# Altium schematic sheet curr_sens_sch.SchDoc
size A; SheetNumber: 1; SheetTotal: 1
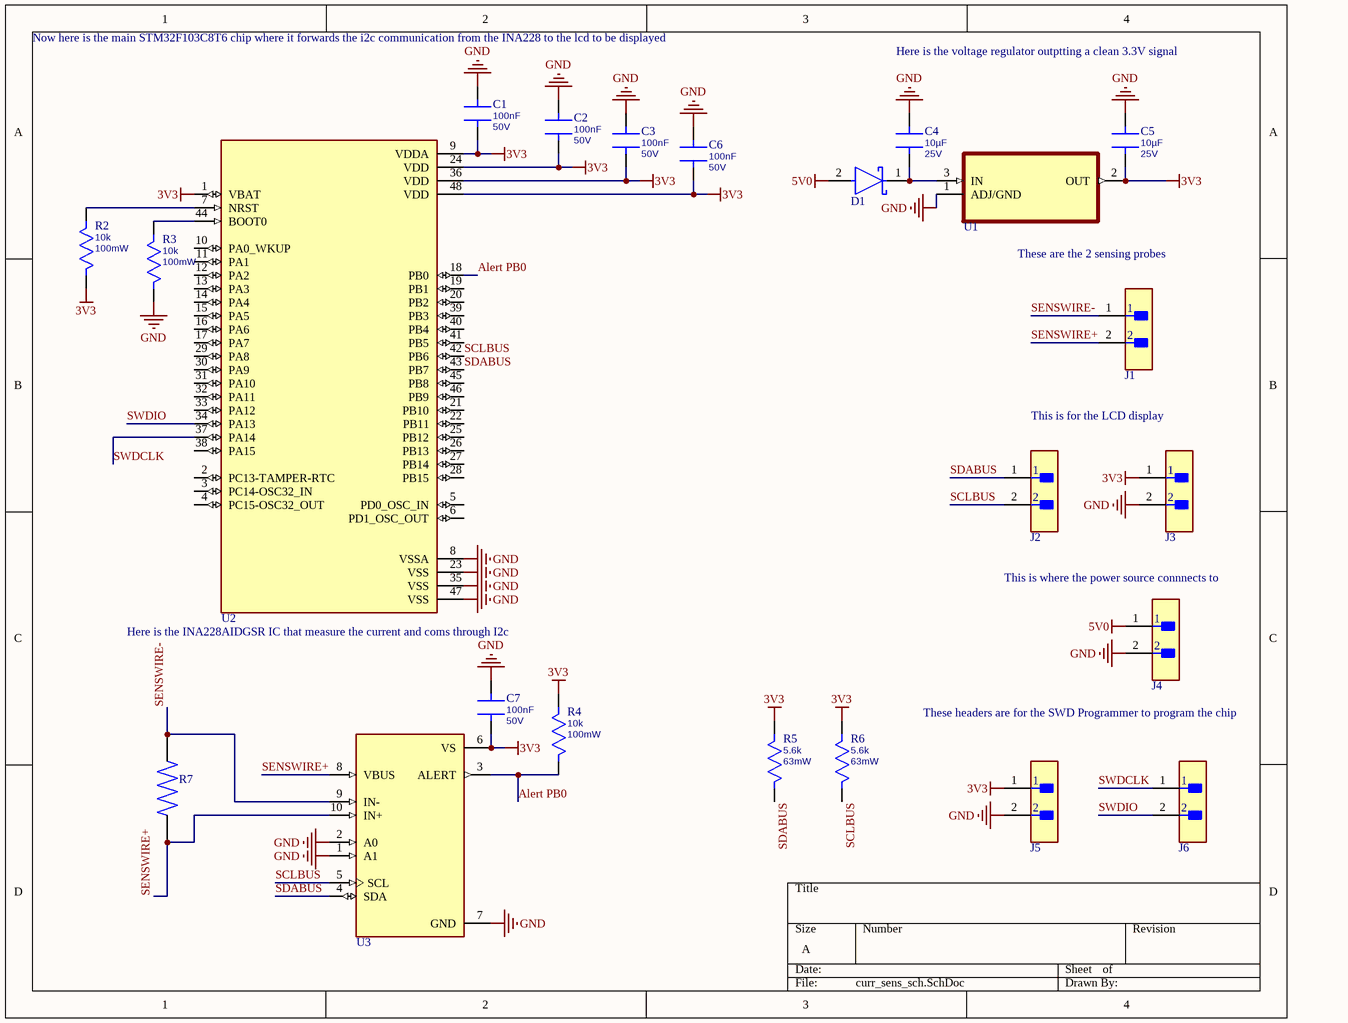
[diagram p0: curr_sens_sch.SchDoc]

## Parts
C1  Capacitance: 100nF  Voltage Rating: 50V  [Standard 0603]  (hidden comment: CAP 100nF 50V X7R 10% 0603 CAP)
C2  Capacitance: 100nF  Voltage Rating: 50V  [Standard 0603]  (hidden comment: CAP 100nF 50V X7R 10% 0603 CAP)
C3  Capacitance: 100nF  Voltage Rating: 50V  [Standard 0603]  (hidden comment: CAP 100nF 50V X7R 10% 0603 CAP)
C4  Capacitance: 10µF  Voltage Rating: 25V  [Standard 0603]  (hidden comment: CAP 10u0 25V X5R 10% 0603)
C5  Capacitance: 10µF  Voltage Rating: 25V  [Standard 0603]  (hidden comment: CAP 10u0 25V X5R 10% 0603)
C6  Capacitance: 100nF  Voltage Rating: 50V  [Standard 0603]  (hidden comment: CAP 100nF 50V X7R 10% 0603 CAP)
C7  Capacitance: 100nF  Voltage Rating: 50V  [Standard 0603]  (hidden comment: CAP 100nF 50V X7R 10% 0603 CAP)
D1  MBR0520LT1G  [FP-425-04-IPC_A]  (value not drawn)
J1  TSW-102-07-F-S  [FP-TSW-102-07-F-S-MFG]  (value not drawn)
J2  TSW-102-07-F-S  [FP-TSW-102-07-F-S-MFG]  (value not drawn)
J3  TSW-102-07-F-S  [FP-TSW-102-07-F-S-MFG]  (value not drawn)
J4  TSW-102-07-F-S  [FP-TSW-102-07-F-S-MFG]  (value not drawn)
J5  TSW-102-07-F-S  [FP-TSW-102-07-F-S-MFG]  (value not drawn)
J6  TSW-102-07-F-S  [FP-TSW-102-07-F-S-MFG]  (value not drawn)
R2  Resistance: 10k  Power Rating: 100mW  [Standard 0603]  (hidden comment: RES 10k 100m 0.1% 0603)
R3  Resistance: 10k  Power Rating: 100mW  [Standard 0603]  (hidden comment: RES 10k 100m 0.1% 0603)
R4  Resistance: 10k  Power Rating: 100mW  [Standard 0603]  (hidden comment: RES 10k 100m 0.1% 0603)
R5  Resistance: 5.6k  Power Rating: 63mW  [Standard 0402]  (hidden comment: RK73B1ETTP562J)
R6  Resistance: 5.6k  Power Rating: 63mW  [Standard 0402]  (hidden comment: RK73B1ETTP562J)
R7  LTR50UZPF2R20  [RESC2550X65N]  (value not drawn)
U1  LM1117T-3.3  [TO254P470X1016X2222-3P]  (value not drawn)
U2  STM32F103C8T6  [QFP50P900X900X160-48N]  (value not drawn)
U3  INA228AIDGSR  [SOP50P490X110-10N]  (value not drawn)

## Nets
3V3: C1.1 C2.1 C3.1 C5.2 C6.1 C7.1 J3.1 J5.1 R2.2 R4.1 R5.1 R6.1 U1.2(OUT) U2.1(VBAT) U2.9(VDDA) U2.24(VDD) U2.36(VDD) U2.48(VDD) U3.6(VS)
5V0: D1.2(A) J4.1
GND: C1.2 C2.2 C3.2 C4.1 C5.1 C6.2 C7.2 J3.2 J4.2 J5.2 R3.2 U1.1(ADJ/GND) U2.8(VSSA) U2.23(VSS) U2.35(VSS) U2.47(VSS) U3.1(A1) U3.2(A0) U3.7(GND)
Alert PB0: R4.2 U2.18(PB0) U3.3(ALERT)
SCLBUS: J2.2 R6.2 U2.42(PB6) U3.5(SCL)
SDABUS: J2.1 R5.2 U2.43(PB7) U3.4(SDA)
SENSWIRE+: J1.2 R7.1 U3.8(VBUS) U3.10(IN+)
SENSWIRE-: J1.1 R7.2 U3.9(IN-)
SWDCLK: J6.1 U2.37(PA14)
SWDIO: J6.2 U2.34(PA13)
NetC4_2: C4.2 D1.1(C) U1.3(IN)
NetR2_1: R2.1 U2.7(NRST)
NetR3_1: R3.1 U2.44(BOOT0)

Not connected (* = marked no-connect by the designer): U2 2(PC13-TAMPER-RTC) 3(PC14-OSC32_IN) 4(PC15-OSC32_OUT) 5(PD0_OSC_IN) 6(PD1_OSC_OUT) 10(PA0_WKUP) 11(PA1) 12(PA2) 13(PA3) 14(PA4) 15(PA5) 16(PA6) 17(PA7) 19(PB1) 20(PB2) 21(PB10) 22(PB11) 25(PB12) 26(PB13) 27(PB14) 28(PB15) 29(PA8) 30(PA9) 31(PA10) 32(PA11) 33(PA12) 38(PA15) 39(PB3) 40(PB4) 41(PB5) 45(PB8) 46(PB9)

## Notes on the sheet
- Now here is the main STM32F103C8T6 chip where it forwards the i2c communication from the INA228 to the lcd to be displayed
- Here is the voltage regulator outptting a clean 3.3V signal
- These are the 2 sensing probes
- This is for the LCD display
- (near U2) Here is the INA228AIDGSR IC that measure the current and coms through I2c
- (near J4) This is where the power source connnects to
- These headers are for the SWD Programmer to program the chip

## Library data of the parts
C1-C3 C6 C7 = CMP-00408-17: 50V 100nF X7R ±10% 0603 Multilayer Ceramic Capacitors MLCC - SMD/SMT ROHS; MPN: CC0603KRX7R9BB104; Polarized (Y/N): N; Temperature Coefficient: X7R; Package: 0603; JLC Part #: C14663; JLC Basic Part (Y/N): Y; Tolerance: 10%
C4 C5 = CMP-00647-3: 10uF 25V X5R ±10% 0603 Multilayer Ceramic Capacitors MLCC - SMD/SMT ROHS; MPN: GRM188R61E106KA73D; Polarized (Y/N): N; Temperature Coefficient: X5R; JLC Basic Part (Y/N): N; JLC Part #: C344022; Package: 0603; Tolerance: 10%
D1 = CMP-00516-1: Diode, Schottky Barrier, Vr 20V, If 0.5A, Pkg SOD-123, Vf 0.385V, Tj +125DEGC, Cs 5.5A; Current Rating: 500mA; Forward Voltage: 385mV; MPN: MBR0520LT1G; Reverse Breakdown Voltage: 20V; JLCPCB Part #: C23848; JLC Basic Part (Y/N): N; Package: SOD-123
J1-J6 = CMP-00417-1: Board Connector, 2 Contact(s), 1 Row(s), Male, Straight, 0.1 inch Pitch, Solder Terminal, Black Insulator; Polarized? (Y/N): N; Num Contacts: 2; JLC Basic Part (Y/N): N; JLCPCB Part #: C3331037; Keyed (Y/N): N; MPN: TSW-102-07-F-S
R2-R4 = CMP-00535-3: -55℃~+155℃ 100mW 10kΩ 75V Thin Film Resistor ±0.1% ±25ppm/℃ 0603 Chip Resistor - Surface Mount ROHS; MPN: RT0603BRD0710KL; Polarized (Y/N): N; Voltage Rating: 75V; Package: 0603; Tolerance: 0.1%; JLCPCB Part #: C95204; JLC Basic Part (Y/N): N
R5 R6 = CMP-00605-2: Res Thick Film 0402 5.6K Ohm 5% 0.1W(1/10W) ±200ppm/C Pad SMD Automotive T/R; Voltage Rating: 50V; Polarized (Y/N): N; MPN: RK73B1ETTP562J; JLCPCB Part #: C131603; JLC Basic Part (Y/N): N; Package: 0402; Tolerance: 5%
R7 = LTR50UZPF2R20: 2.2 Ohms Â±1% 1W Chip Resistor Wide 2010 (5025 Metric), 1020 Automotive AEC-Q200, Pulse Withstanding Thick Film; MF: Rohm; SnapEDA_Link: https://www.snapeda.com/parts/LTR50UZPF2R20/Rohm/view-part/?ref=snap; Package: 2550 ROHM; Value: *; MP: LTR50UZPF2R20; Check_prices: https://www.snapeda.com/parts/LTR50UZPF2R20/Rohm/view-part/?ref=eda
U1 = LM1117T-3.3: Linear Voltage Regulator IC Positive Fixed 1 Output 800mA TO-220-3; MF: Texas Instruments; Package: TO-220-3 TEXAS INSTRUMENTS; Price: None; Check_prices: https://www.snapeda.com/parts/LM1117T-3.3/Texas+Instruments/view-part/?ref=eda; Value: *; SnapEDA_Link: https://www.snapeda.com/parts/LM1117T-3.3/Texas+Instruments/view-part/?ref=snap; MP: LM1117T-3.3; Availability: In Stock; Purchase-URL: https://pricing.snapeda.com/search/part/LM1117T-3.3/?ref=eda
U2 = STM32F103C8T6: ARM® Cortex®-M3 STM32F1 Microcontroller IC 32-Bit 72MHz 64KB (64K x 8) FLASH 48-LQFP (7x7); MF: STMicroelectronics; SnapEDA_Link: https://www.snapeda.com/parts/STM32F103C8T6/STMicroelectronics/view-part/?ref=snap; Package: LQFP-48 STMicroelectronics; Value: *; MP: STM32F103C8T6; Check_prices: https://www.snapeda.com/parts/STM32F103C8T6/STMicroelectronics/view-part/?ref=eda
U3 = INA228AIDGSR: 85-V, 20-bit, ultra-precise, I2C output current/voltage/power/energy/charge monitor with alert; MF: Texas Instruments; SnapEDA_Link: https://www.snapeda.com/parts/INA228AIDGSR/Texas+Instruments/view-part/?ref=snap; Package: VSSOP-10 Texas Instruments; Value: *; MP: INA228AIDGSR; Check_prices: https://www.snapeda.com/parts/INA228AIDGSR/Texas+Instruments/view-part/?ref=eda